# EAGLE design SController-8833 (EAGLE 9.4.2)
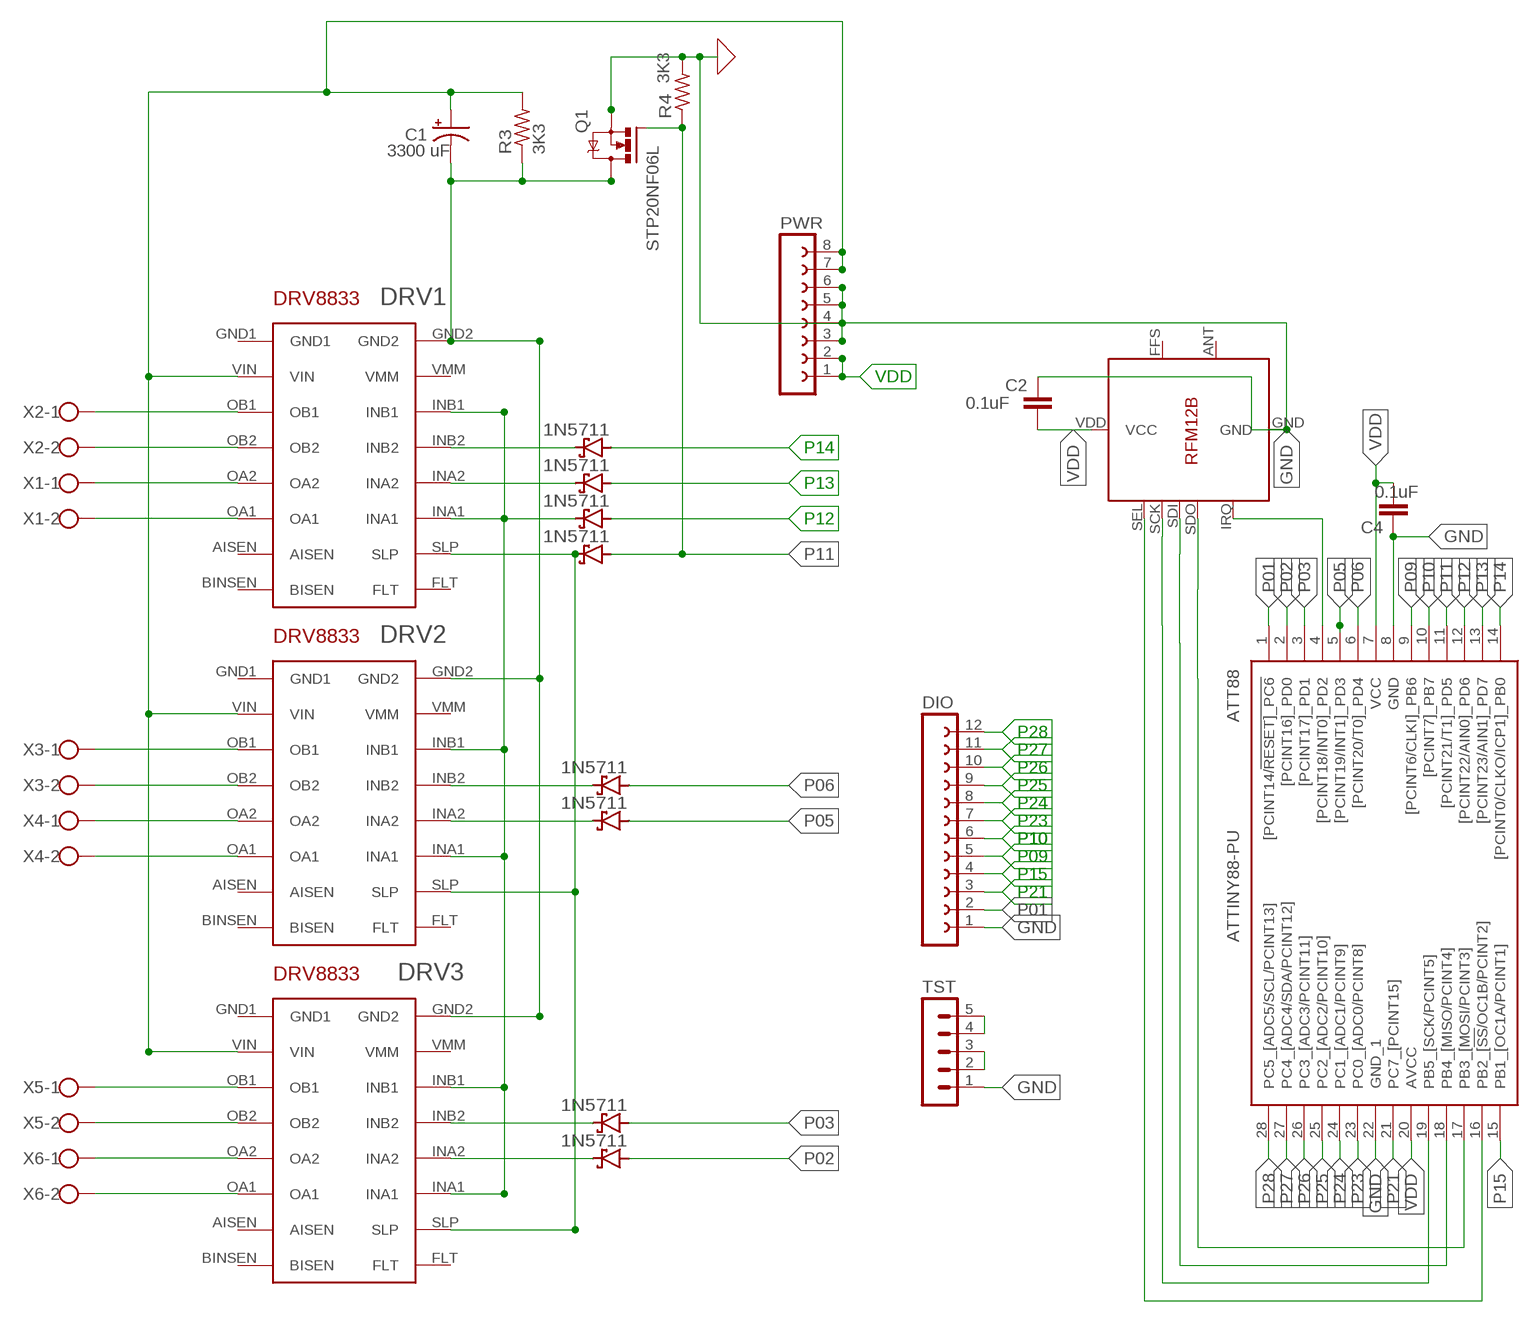
[diagram p0: schematic, sheet 1]

## Parts
1  DRV1  POLOLU-DRV8833  [POLOLU-DRV8833]
2  DRV2  POLOLU-DRV8833  [POLOLU-DRV8833]
3  DRV3  POLOLU-DRV8833  [POLOLU-DRV8833]
ATT88  ATTINY88-PU  [DIP794W53P254L3467H457Q28N]
C1  3300 uF  CPOL-USE5-10.5  [E5-10,5]
C2  0.1uF  C2.5/2  [C2.5-2]
C4  0.1uF  C2.5/2  [C2.5-2]
D1  1N5711  SCHOTTKY-DIODEF126Z12  [F126Z12]
D2  1N5711  SCHOTTKY-DIODEF126Z12  [F126Z12]
D3  1N5711  SCHOTTKY-DIODEF126Z12  [F126Z12]
D4  1N5711  SCHOTTKY-DIODEF126Z12  [F126Z12]
D5  1N5711  SCHOTTKY-DIODEF126Z12  [F126Z12]
D6  1N5711  SCHOTTKY-DIODEF126Z12  [F126Z12]
D7  1N5711  SCHOTTKY-DIODEF126Z12  [F126Z12]
D8  1N5711  SCHOTTKY-DIODEF126Z12  [F126Z12]
DIO  FE12-1  [FE12]
PWR  FE08-1  [FE08]
Q1  STP20NF06L  IRF540  [TO220BV]
R3  3K3  R-US_0204/7  [0204/7]
R4  3K3  R-US_0204/7  [0204/7]
RFM69CW  RFM69CW  RFM12B  [RFM12B]
TST  MA05-1  [MA05-1]
X1  W237-102  [W237-102]
X2  W237-102  [W237-102]
X3  W237-102  [W237-102]
X4  W237-102  [W237-102]
X5  W237-102  [W237-102]
X6  W237-102  [W237-102]

## Nets
CMN1: 1.INA1 1.INB1 2.INA1 2.INB1 3.INA1 3.INB1 D3.C
GND [2Amp]: ATT88.8(GND) ATT88.22(GND_1) C2.2 C4.1 DIO.1 PWR.3 PWR.4 PWR.5 PWR.6 Q1.S R4.2 RFM69CW.GND TST.1
IRQ: ATT88.4([PCINT18/INT0]_PD2) RFM69CW.IRQ
N$1: 2.INB2 D5.C
N$2: 1.INB2 D1.C
N$7: TST.4 TST.5
N$8: TST.2 TST.3
N$13: 1.INA2 D2.C
N$18: 3.INB2 D7.C
N$19: 2.INA2 D6.C
N$25: 3.INA2 D8.C
OA11 [2Amp]: 1.OA1 X1.2
OA12 [2Amp]: 2.OA1 X4.2
OA13 [2Amp]: 3.OA1 X6.2
OA21 [2Amp]: 1.OA2 X1.1
OA22 [2Amp]: 2.OA2 X4.1
OA23 [2Amp]: 3.OA2 X6.1
OB11 [2Amp]: 1.OB1 X2.1
OB12 [2Amp]: 2.OB1 X3.1
OB13 [2Amp]: 3.OB1 X5.1
OB21 [2Amp]: 1.OB2 X2.2
OB22 [2Amp]: 2.OB2 X3.2
OB23 [2Amp]: 3.OB2 X5.2
P01: ATT88.1([PCINT14/!RESET]_PC6) DIO.2
P02: ATT88.2([PCINT16]_PD0) D8.A
P03: ATT88.3([PCINT17]_PD1) D7.A
P05: ATT88.5([PCINT19/INT1]_PD3) D6.A
P06: ATT88.6([PCINT20/T0]_PD4) D5.A
P09: ATT88.9([PCINT6/CLKI]_PB6) DIO.5
P10: ATT88.10([PCINT7]_PB7) DIO.6
P11: ATT88.11([PCINT21/T1]_PD5) D4.A Q1.G R4.1
P12: ATT88.12([PCINT22/AIN0]_PD6) D3.A
P13: ATT88.13([PCINT23/AIN1]_PD7) D2.A
P14: ATT88.14([PCINT0/CLKO/ICP1]_PB0) D1.A
P15: ATT88.15(PB1_[OC1A/PCINT1]) DIO.4
P21: ATT88.21(PC7_[PCINT15]) DIO.3
P23: ATT88.23(PC0_[ADC0/PCINT8]) DIO.7
P24: ATT88.24(PC1_[ADC1/PCINT9]) DIO.8
P25: ATT88.25(PC2_[ADC2/PCINT10]) DIO.9
P26: ATT88.26(PC3_[ADC3/PCINT11]) DIO.10
P27: ATT88.27(PC4_[ADC4/SDA/PCINT12]) DIO.11
P28: ATT88.28(PC5_[ADC5/SCL/PCINT13]) DIO.12
SCK: ATT88.19(PB5_[SCK/PCINT5]) RFM69CW.SCK
SDI: ATT88.18(PB4_[MISO/PCINT4]) RFM69CW.SDI
SDO: ATT88.17(PB3_[MOSI/PCINT3]) RFM69CW.SDO
SEL: ATT88.16(PB2_[!SS!/OC1B/PCINT2]) RFM69CW.SEL
SLP: 1.SLP 2.SLP 3.SLP D4.C
VDD: ATT88.7(VCC) ATT88.20(AVCC) C2.1 C4.2 PWR.1 PWR.2 RFM69CW.VDD(VCC)
VGND [2Amp]: 1.GND2 2.GND2 3.GND2 C1.- Q1.D R3.1
VIN [2Amp]: 1.VIN 2.VIN 3.VIN C1.+ PWR.7 PWR.8 R3.2
Unconnected: 1.AISEN 1.BINSEN(BISEN) 1.FLT 1.GND1 1.VMM 2.AISEN 2.BINSEN(BISEN) 2.FLT 2.GND1 2.VMM 3.AISEN 3.BINSEN(BISEN) 3.FLT 3.GND1 3.VMM RFM69CW.ANT RFM69CW.FFS

## Library data of the parts
1-3 = Pololu_Driver_DRV8833:POLOLU-DRV8833: Created by: Deltarios DRV8833 pololu dual drive controller, PCB-ready device
ATT88 = ATTINY88-PU:ATTINY88-PU: ATTINY88-PU, 8 bit AVR Microcontroller 12MHz 64 B, 8 kB Flash, 512 B RAM, I2C 28-Pin PDIP Source: Datasheet <http://www.atmel.com/images/8008s.pdf>; DESCRIPTION: ATTINY88-PU, 8 bit AVR Microcontroller 12MHz 64 B, 8 kB Flash, 512 B RAM, I2C 28-Pin PDIP; HEIGHT: 4.572mm; MANUFACTURER_NAME: Microchip; MANUFACTURER_PART_NUMBER: ATTINY88-PU; MOUSER_PART_NUMBER: 556-ATTINY88-PU; MOUSER_PRICE-STOCK: https://www.mouser.com/Search/Refine.aspx?Keyword=556-ATTINY88-PU; RS_PART_NUMBER: 6962406; RS_PRICE-STOCK: https://uk.rs-online.com/web/p/products/6962406
C1 = rcl:CPOL-US: POLARIZED CAPACITOR, American symbol; SPICEPREFIX: C
C2 C4 = capacitor-wima:C: CAPACITOR naming: grid - package width
D1-D8 = diode:SCHOTTKY-DIODE: Schottky Diode
DIO = con-lsta:FE12-1: FEMALE HEADER; OC_FARNELL: unknown; OC_NEWARK: unknown
PWR = con-lsta:FE08-1: FEMALE HEADER; OC_FARNELL: unknown; OC_NEWARK: unknown
Q1 = transistor-power:IRF540: HEXFET Power MOSFET
R3 = rcl:R-US_: RESISTOR, American symbol; SPICEPREFIX: R
R4 = rcl:R-US_: RESISTOR, American symbol; SPICEPREFIX: 3K3
RFM69CW = JeeParts:RFM12B
TST = con-lstb:MA05-1: PIN HEADER; OC_FARNELL: unknown; OC_NEWARK: unknown
X1-X6 = con-wago-500:W237-102: WAGO SCREW CLAMP; MPN: 237-102; OC_FARNELL: unknown; OC_NEWARK: 70K9898

## Net classes
0 default: width 0.508 mm, drill 0.508 mm, clearance 0.254 mm
1 2Amp: width 1.016 mm, drill 1.016 mm, clearance 0.508 mm

## Board
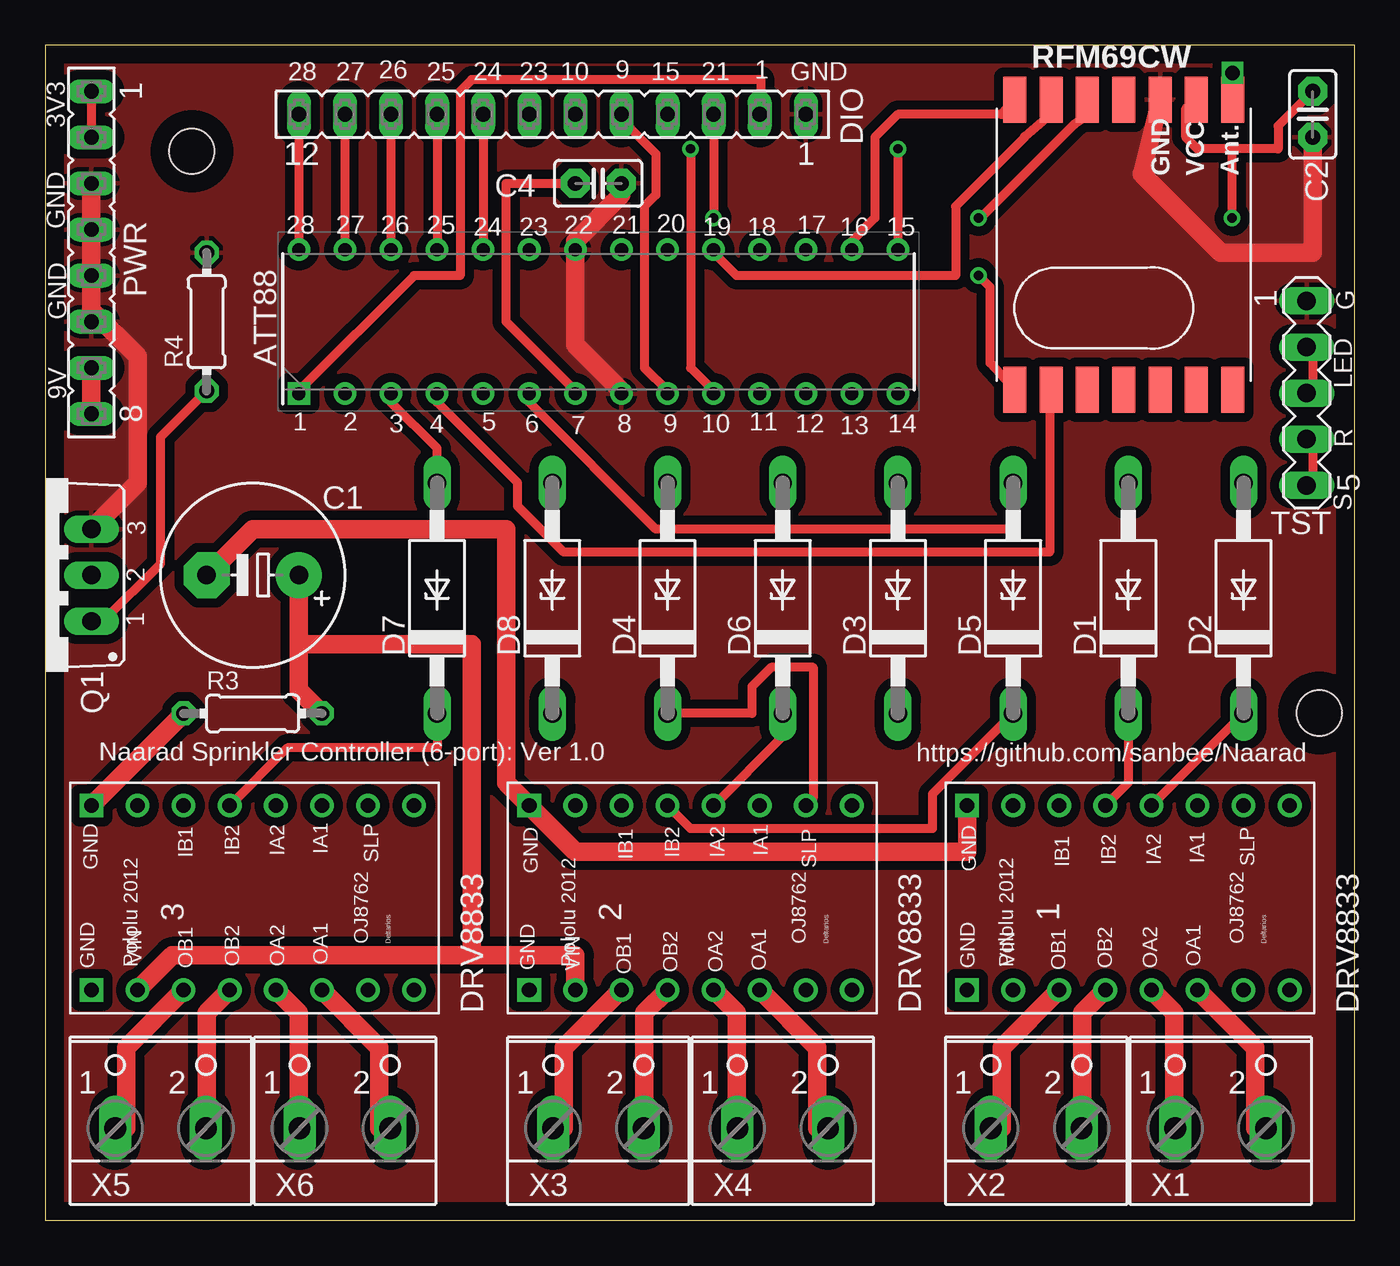
[diagram p1: board, top side]
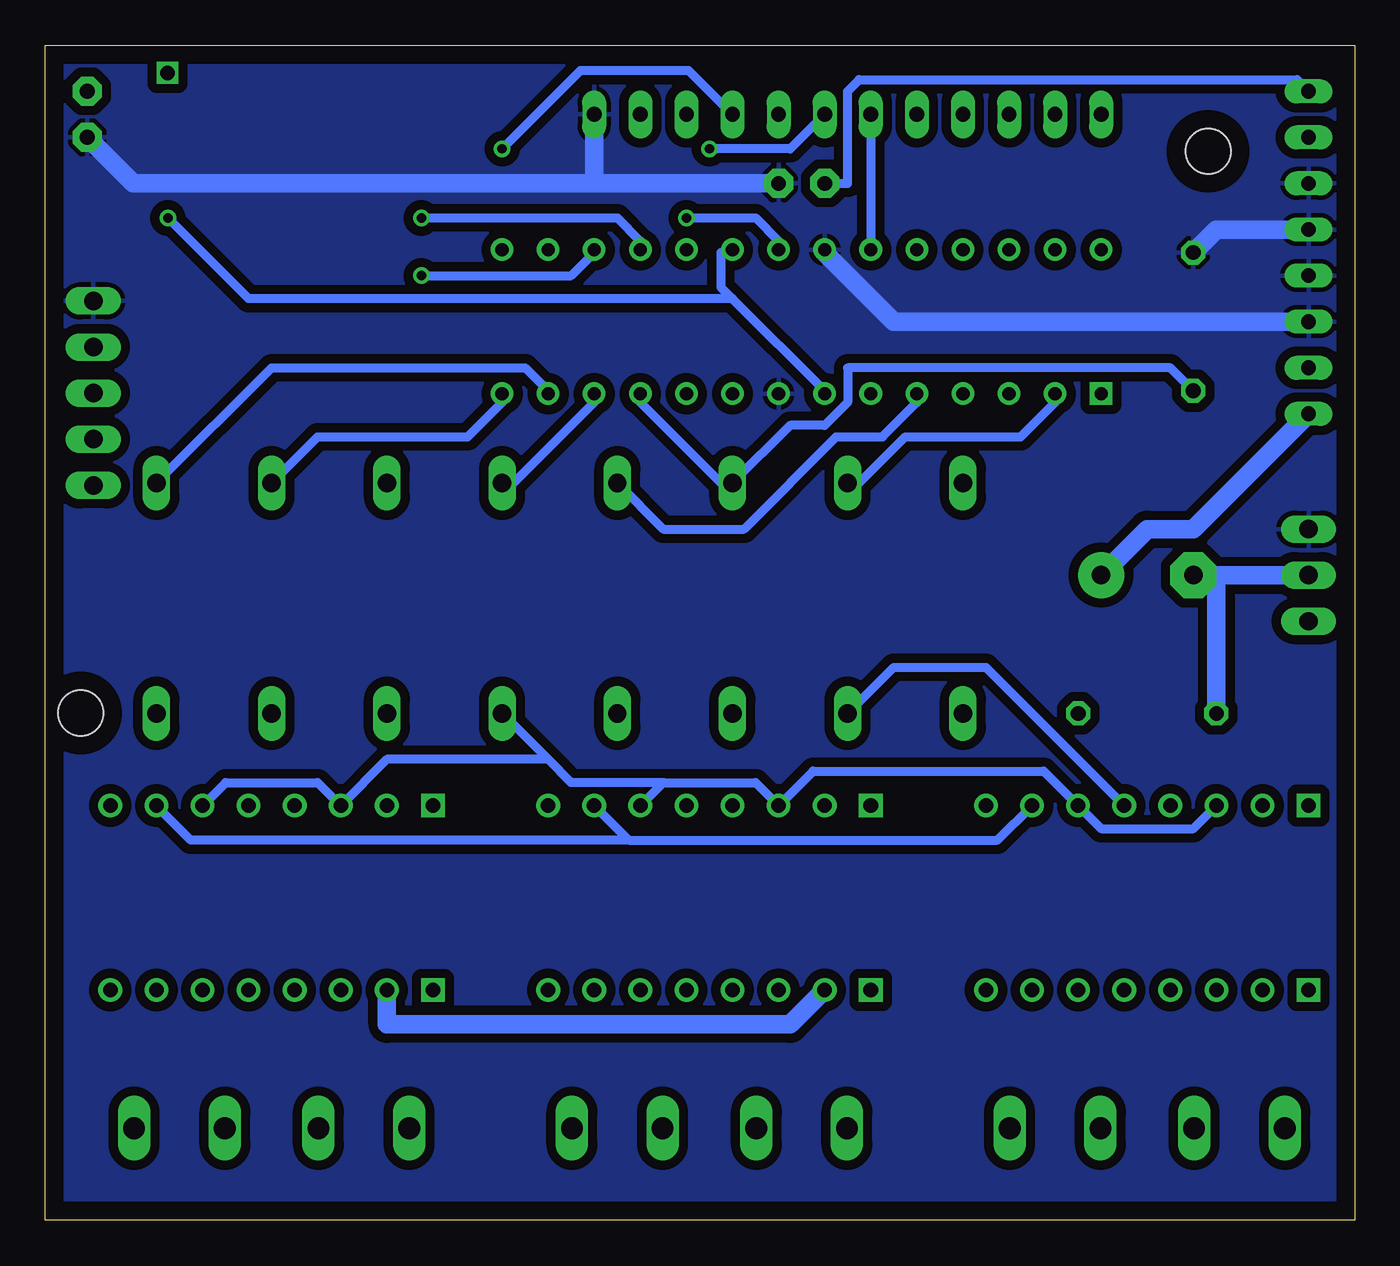
[diagram p2: board, bottom side, seen from below]

Size 72.16 x 64.76 mm. Coordinates in mm from the lower left corner, seen from the top.
Outline: 0,0 72.16,0 72.16,64.76 0,64.76 0,0
Copper layers (1*16): Top 0.035mm / dielectric 1.5mm / Bottom 0.035mm
Design rules "default": minimum track width 6mil, minimum drill 0.35mm, track to track 6mil, track to pad 6mil, pad to pad 6mil, via to via 6mil, smd to smd 6mil, copper to edge 40mil, drill to drill 6mil, minimum pad ring 10mil, minimum via ring 8mil, stop-mask expansion 4mil, vias tented up to drill 0mil, thermal gap 10mil
Holes 2.5 mm at 8.08,58.93 70.21,27.97

### Footprints (pad centres in the part's own frame; a part is rotated, then mirrored left to right if it is on the bottom)
POLOLU-DRV8833 = drill 0.8: AISEN -3.81,-7.62; BINSEN -3.81,-10.16; FLT 6.35,-10.16; INA1 6.35,-5.08; INA2 6.35,-2.54; INB1 6.35,2.54; INB2 6.35,0; OA1 -3.81,-5.08; OA2 -3.81,-2.54; OB1 -3.81,2.54; OB2 -3.81,0; SLP 6.35,-7.62; VIN -3.81,5.08; VMM 6.35,5.08 | drill 0.8 square: GND1 -3.81,7.62; GND2 6.35,7.62
DIP794W53P254L3467H457Q28N = drill 0.733 pad 1.133 square: 1 -3.969,16.51 | drill 0.733 pad 1.133: 2 -3.969,13.97; 3 -3.969,11.43; 4 -3.969,8.89; 5 -3.969,6.35; 6 -3.969,3.81; 7 -3.969,1.27; 8 -3.969,-1.27; 9 -3.969,-3.81; 10 -3.969,-6.35; 11 -3.969,-8.89; 12 -3.969,-11.43; 13 -3.969,-13.97; 14 -3.969,-16.51; 15 3.969,-16.51; 16 3.969,-13.97; 17 3.969,-11.43; 18 3.969,-8.89; 19 3.969,-6.35; 20 3.969,-3.81; 21 3.969,-1.27; 22 3.969,1.27; 23 3.969,3.81; 24 3.969,6.35; 25 3.969,8.89; 26 3.969,11.43; 27 3.969,13.97; 28 3.969,16.51
E5-10,5 = drill 1.016 pad 2.54: + -2.54,0 | drill 1.016 pad 2.54 octagon: - 2.54,0
C2.5-2 = drill 0.813 pad 1.6 octagon: 1 -1.27,0; 2 1.27,0
F126Z12 = drill 1.016 long: A 6.35,0; C -6.35,0
FE12 = drill 0.813 long: 1 -13.97,0; 2 -11.43,0; 3 -8.89,0; 4 -6.35,0; 5 -3.81,0; 6 -1.27,0; 7 1.27,0; 8 3.81,0; 9 6.35,0; 10 8.89,0; 11 11.43,0; 12 13.97,0
FE08 = drill 0.813 long: 1 -8.89,0; 2 -6.35,0; 3 -3.81,0; 4 -1.27,0; 5 1.27,0; 6 3.81,0; 7 6.35,0; 8 8.89,0
TO220BV = drill 1.016 long: D 0,-2.54; G -2.54,-2.54; S 2.54,-2.54
0204/7 = drill 0.813 octagon: 1 -3.81,0; 2 3.81,0
RFM12B = smd 2.54 x 1.27: ANT 8,-6; FFS -8,2; GND 8,-2; IRQ -8,4; P$8 -8,0; P$9 -8,-2; P$10 -8,-4; P$12 -8,-6; P$16 8,0; SCK 8,4; SDI 8,2; SDO -8,6; SEL 8,6; VDD 8,-4
MA05-1 = drill 1.016 long: 1 -5.08,0; 2 -2.54,0; 3 0,0; 4 2.54,0; 5 5.08,0
W237-102 = drill 1.194 long: 1 -2.5,-1.27; 2 2.5,-1.27

### Placement (x,y rotation side)
1  58.42,16.51 90 top
2  34.29,16.51 90 top
3  10.16,16.51 90 top
ATT88  30.48,49.53 90 top
C1  11.43,35.56 180 top
C2  69.85,60.96 270 top
C4  30.48,57.15 180 top
D1  59.69,34.29 90 top
D2  66.04,34.29 90 top
D3  46.99,34.29 90 top
D4  34.29,34.29 90 top
D5  53.34,34.29 90 top
D6  40.64,34.29 90 top
D7  21.59,34.29 90 top
D8  27.94,34.29 90 top
DIO  27.94,60.96 180 top
PWR  2.54,53.34 270 top
Q1  0,35.56 90 top
R3  11.43,27.94 0 top
R4  8.89,49.53 90 top
RFM69CW  59.44,53.77 90 top
TST  69.52,45.59 270 top
X1  64.77,6.35 0 top
X2  54.61,6.35 0 top
X3  30.48,6.35 0 top
X4  40.64,6.35 0 top
X5  6.35,6.35 0 top
X6  16.51,6.35 0 top

### Tracks (layer width: path | path; a pad name or v marks a point on that pad's centre or on a via)
CMN1
  Bottom 0.508: 1.INA1 62.23,24.13 57.15,24.13 1.INB1 53.34,25.4 44.45,25.4 | 3.INB1 8.89,21.59 13.97,21.59 3.INA1 17.14,24.77 29.84,24.77 2.INB1 33.02,24.13 38.1,24.13 | 2.INA1 38.1,24.13 | 44.45,25.4 43.18,24.13 38.1,24.13 | 44.45,25.4 D3.C
GND
  Top 1.016: C2.2 69.85,53.34 64.77,53.34 60.42,57.69 RFM69CW.GND | C4.1 31.75,56.52 29.21,53.98 ATT88.22 29.21,48.26 31.75,45.72 ATT88.8 | PWR.3 PWR.4 PWR.5 2.54,50.16 | Q1.S 5.08,40.64 5.08,47.62 2.54,50.16 | 2.54,50.16 PWR.6
  Bottom 1.016: R4.2 7.62,54.61 PWR.4 | PWR.6 25.4,49.53 29.21,53.34 ATT88.22 | C2.2 67.31,57.15 41.91,57.15 | C4.1 41.91,57.15 | 41.91,57.15 DIO.1
  pour Top: 0,64.52 0,0 72.14,0 72.14,65.02 0.51,65.02
  pour Bottom: 0,65.02 0,0 72.24,0 72.24,65.02
IRQ
  Top 0.508: ATT88.4 21.59,45.09 26.04,40.64 26.04,39.37 28.57,36.83 55.35,36.83 55.35,45.65 RFM69CW.IRQ
N$1
  Top 0.508: 2.INB2 35.56,21.59 48.9,21.59 48.9,23.5 D5.C
N$2
  Top 0.508: 1.INB2 59.69,24.13 D1.C
N$6  (via drill 0.8)
  other vias: 65.43,63.25
N$7
  Top 0.508: TST.5 69.85,40.64 69.85,42.55 TST.4
N$8
  Top 0.508: TST.3 69.85,45.72 69.85,47.62 TST.2
N$13
  Top 0.508: D2.C 1.INA2
N$18
  Top 0.508: 3.INB2 13.34,26.04 21.59,26.04 D7.C
N$19
  Top 0.508: 2.INA2 40.64,26.67 D6.C
N$25
  Bottom 0.508: 3.INA2 20.32,30.48 25.4,30.48 D8.C
OA11
  Top 1.016: 1.OA1 66.67,9.53 66.67,5.08 X1.2
OA12
  Top 1.016: 2.OA1 42.55,9.53 42.55,5.08 X4.2
OA13
  Top 1.016: 3.OA1 18.41,9.53 18.41,5.08 X6.2
OA21
  Top 1.016: 1.OA2 62.23,11.43 62.23,5.08 X1.1
OA22
  Top 1.016: 2.OA2 38.1,11.43 38.1,5.08 X4.1
OA23
  Top 1.016: 3.OA2 13.97,11.43 13.97,5.08 X6.1
OB11
  Top 1.016: 1.OB1 52.7,9.53 52.7,5.08 X2.1
OB12
  Top 1.016: 2.OB1 28.57,9.53 28.57,5.08 X3.1
OB13
  Top 1.016: 3.OB1 4.45,9.53 4.45,5.08 X5.1
OB21
  Top 1.016: 1.OB2 57.15,11.43 57.15,5.08 X2.2
OB22
  Top 1.016: 2.OB2 33.02,11.43 33.02,5.08 X3.2
OB23
  Top 1.016: 3.OB2 8.89,11.43 8.89,5.08 X5.2
P01
  Top 0.508: 14.03,45.78 20.32,52.07 22.86,52.07 22.86,62.23 23.5,62.87 39.43,62.87 39.43,60.96 DIO.2 | 14.03,45.78 13.97,45.72 | ATT88.1 14.1,45.72 14.03,45.78
P02
  Bottom 0.508: D8.A 27.3,40.64 24.77,43.18 18.41,43.18 16.51,45.09 ATT88.2
P03
  Top 0.508: D7.A 21.59,42.55 19.05,45.09 ATT88.3
P05
  Bottom 0.508: D6.A 38.1,38.1 33.66,38.1 28.57,43.18 26.04,43.18 24.13,45.09 ATT88.5
P06
  Top 0.508: D5.A 53.34,38.1 33.66,38.1 26.67,45.09 ATT88.6
P09
  Top 0.508: DIO.5 31.75,60.68 33.66,58.78 33.66,56.52 33.02,55.88 33.02,46.99 34.29,45.72 ATT88.9
P10  (via drill 0.51)
  Top 0.508: v35.56,59.05 35.56,46.99 36.83,45.72 ATT88.10
  Bottom 0.508: v35.56,59.05 31.11,59.05 DIO.6
P11
  Top 0.508: R4.1 6.35,43.18 6.35,36.2 3.17,33.02 Q1.G
  Bottom 0.508: ATT88.11 39.37,45.09 34.92,40.64 D4.A 31.11,43.81 29.21,43.81 27.94,45.09 27.94,46.99 10.16,46.99 R4.1
P12
  Bottom 0.508: D3.A 46.35,40.64 41.91,45.09 ATT88.12
P13
  Bottom 0.508: D2.A 59.69,46.99 45.72,46.99 44.45,45.72 ATT88.13
P14
  Bottom 0.508: D1.A 57.15,43.18 48.9,43.18 46.99,45.09 ATT88.14
P15  (via drill 0.51)
  Top 0.508: v46.99,59.05 ATT88.15
  Bottom 0.508: v46.99,59.05 42.67,63.37 36.7,63.37 DIO.4
P21  (via drill 0.51)
  Top 0.508: DIO.3 v36.83,55.24
  Bottom 0.508: v36.83,55.24 33.02,55.24 31.75,53.98 ATT88.21
P23
  Bottom 0.508: DIO.7 ATT88.23
P24
  Top 0.508: DIO.8 ATT88.24
P25
  Top 0.508: DIO.9 ATT88.25
P26
  Top 0.508: DIO.10 ATT88.26
P27
  Top 0.508: DIO.11 ATT88.27
P28
  Top 0.508: DIO.12 ATT88.28
SCK
  Top 0.508: ATT88.19 36.83,53.34 38.1,52.07 50.16,52.07 50.16,55.88 53.98,59.69 53.98,59.73 55.54,61.07 55.54,61.67 RFM69CW.SCK
SDI  (via drill 0.51)
  Top 0.508: v51.44,55.24 51.56,55.24 56.72,60.4 57.44,60.91 RFM69CW.SDI
  Bottom 0.508: v51.44,55.24 40.64,55.24 39.37,53.98 ATT88.18
SDO  (via drill 0.51)
  Top 0.508: v51.44,52.07 52.07,51.44 52.07,47.26 RFM69CW.SDO
  Bottom 0.508: v51.44,52.07 43.18,52.07 41.91,53.34 ATT88.17
SEL
  Top 0.508: ATT88.16 44.45,53.98 45.72,55.24 45.72,59.69 46.99,60.96 52.69,60.96 RFM69CW.SEL
SLP
  Top 0.508: D4.C 38.94,27.94 38.94,29.41 40.01,30.48 42.32,30.48 42.32,23.27 2.SLP
  Bottom 0.508: 3.SLP 19.68,20.95 40.01,20.95 | 2.SLP 40.01,20.95 | 1.SLP 64.14,20.95 40.01,20.95
VDD  (via drill 0.51)
  Top 0.508: 65.41,59.05 67.94,59.05 67.94,60.33 C2.1 | 65.41,59.05 63.5,59.05 62.87,59.69 62.87,61.28 RFM69CW.VDD | PWR.1 PWR.2 | C4.2 25.4,57.15 25.4,49.53 29.21,45.72 ATT88.7 | v65.41,55.24 65.41,59.05
  Bottom 0.508: 34.29,50.8 34.92,51.44 34.92,53.34 34.29,53.34 ATT88.20 | 34.29,50.8 29.21,45.72 ATT88.7 | PWR.1 3.17,62.87 27.3,62.87 27.94,62.23 27.94,57.15 C4.2 | v65.41,55.24 60.96,50.8 34.29,50.8
VGND
  Top 1.016: R3.1 3.GND2 | 1.GND2 50.8,20.32 29.21,20.32 2.GND2 25.4,24.13 25.4,38.1 11.43,38.1 C1.-
  Bottom 1.016: C1.- 7.62,35.56 | 7.62,35.56 Q1.D | 7.62,35.56 R3.1
VIN
  Top 1.016: PWR.7 PWR.8 | R3.2 13.97,29.21 13.97,31.75 | C1.+ 13.97,31.75 | 3.VIN 6.99,14.61 23.5,14.61 | 23.5,14.61 29.21,14.61 2.VIN | 13.97,31.75 23.5,31.75 23.5,14.61
  Bottom 1.016: PWR.8 8.89,38.1 11.43,38.1 C1.+ | 1.VIN 53.34,10.79 31.11,10.79 2.VIN

### Text on the board
tPlace: IB1 | IB2 | IA2 | IA1 | SLP | IB1 | IB2 | IA2 | IA1 | IB2 | IA2 | IA1 | SLP | GND | GND | SLP | GND | IB1 | GND | VIN | OB1 | OB2 | OA2 | OA1 | GND | VIN | OB1 | OB2 | OA2 | OA1 | GND | VIN | OB1 | OB2 | OA2 | OA1
tNames: 28 | 27 | 26 | 25 | 24 | 23 | 10 | 9 | 15 | 21 | 1 | GND | 3V3 | GND | 28 | 27 | 26 | 25 | 24 | 23 | 22 | 21 | 20 | 19 | 18 | 17 | 16 | 15 | GND | G | LED | 9V | 1 | 2 | 5 | 11 | 3 | 4 | 6 | 7 | 8 | 9 | 10 | 12 | 13 | 14 | R | S | 3 | 2 | 1 | Naarad Sprinkler Controller (6-port): Ver 1.0 | https://github.com/sanbee/Naarad